# Altium schematic sheet 105358-3SC001-02_IO_BRD.SchDoc: I/O Board
size 420 x 297 mm; DrawnBy: JeSa , KaKa; Organization: Hotswap Norden AB; Address1: Knarrarnäsgatan 7; Address2: SE-164 40 Kista; Address3: Sweden; DocumentNumber: 105358-3SC001-02; SheetNumber: 5; SheetTotal: 5; PageSetup: Record=PageOptions|CenterHorizontal=True|CenterVertical=True|PrintScale=0.96|XCorrection=1.00|YCorrection=1.00|PrintKind=0|BorderSize=5000000|LeftOffset=0|BottomOffset=0|Orientation=2|PaperLength=1000|PaperWidth=1000|Scale=100|PaperSource=7|PrintQuality=-4|MediaType=1|DitherType=10|PaperKind=A3|PrintScaleMode=1
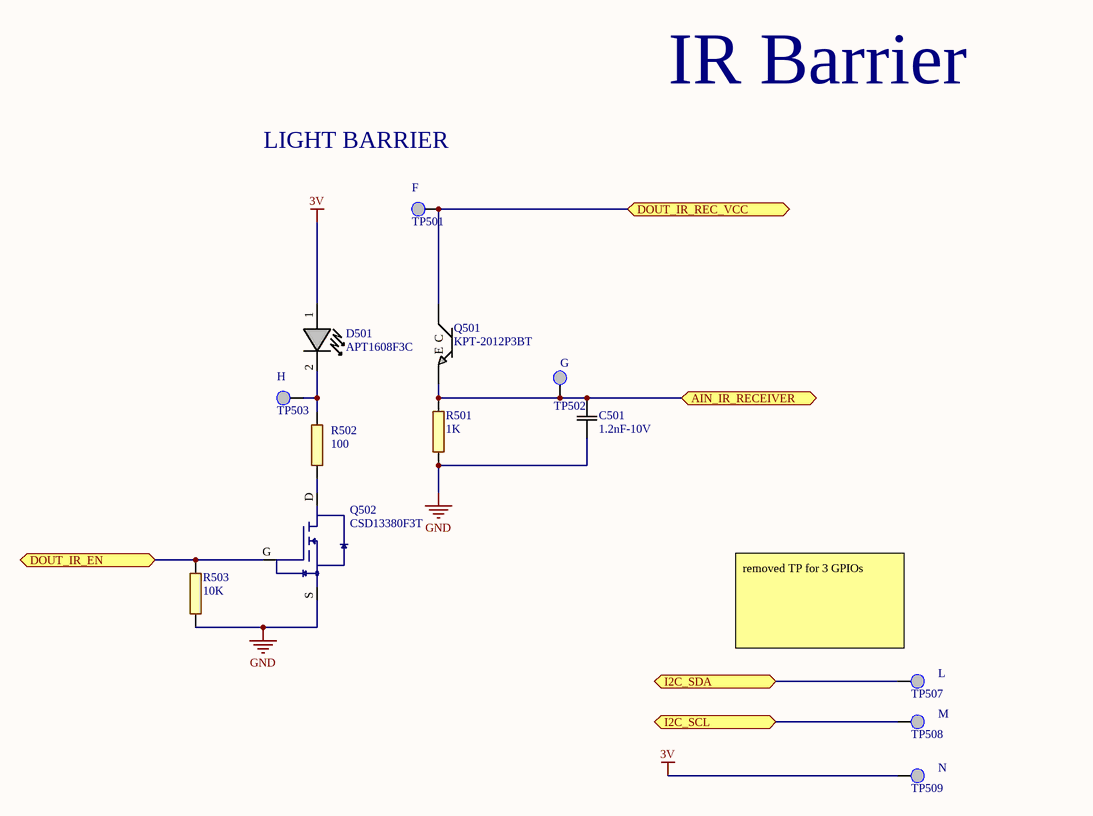
[diagram p0: 105358-3SC001-02_IO_BRD.SchDoc]

## Parts
C501  1.2nF-10V  [0402C_HIGH_DENSITY]
D501  APT1608F3C  [APT1608F3C]
Q501  KPT-2012P3BT  [APT2012P3BT]
Q502  CSD13380F3T  [CSD13380F3-DFN40P69X35-3L]
R501  1K  [0402R-GENERIC]
R502  100  [0402R-GENERIC]
R503  10K  [0402R-GENERIC]
TP501  TEST POINT  [PAD TEST POINT]  (value not drawn)  (no BOM)
TP502  TEST POINT  [PAD TEST POINT]  (value not drawn)  (no BOM)
TP503  TEST POINT  [PAD TEST POINT]  (value not drawn)  (no BOM)
TP507  TEST POINT  [PAD TEST POINT]  (value not drawn)  (no BOM)
TP508  TEST POINT  [PAD TEST POINT]  (value not drawn)  (no BOM)
TP509  TEST POINT  [PAD TEST POINT]  (value not drawn)  (no BOM)

## Ports
AIN_IR_RECEIVER, DOUT_IR_EN, DOUT_IR_REC_VCC, I2C_SCL, I2C_SDA

## Nets
3V: D501.1(A) TP509.1(Test_Point)
GND: C501.1 Q502.S R501.2 R503.2
AIN_IR_RECEIVER: C501.2 Q501.1(E) R501.1 TP502.1(Test_Point) ; port AIN_IR_RECEIVER
DOUT_IR_EN: Q502.G R503.1 ; port DOUT_IR_EN
DOUT_IR_REC_VCC: Q501.2(C) TP501.1(Test_Point) ; port DOUT_IR_REC_VCC
I2C_SCL: TP508.1(Test_Point) ; port I2C_SCL
I2C_SDA: TP507.1(Test_Point) ; port I2C_SDA
NetD501_2: D501.2(K) R502.1 TP503.1(Test_Point)
NetQ502_D: Q502.D R502.2

## Notes on the sheet
- IR Barrier
- LIGHT BARRIER
- (near TP501) F
- (near TP503) H
- (near TP502) G
- (near TP507) removed TP for 3 GPIOs
- (near TP507) L
- M
- (near TP509) N
- Title
- Customer, project
- Drawn By
- Board
- Size
- Document Number
- Sheet
- of
- Last modified
- Rev
- Build
- A3

## Library data of the parts
C501 = 0402C-1.2nF-10V: 1.2nF ±10% 10V U2J Ceramic Capacitor 0402; Manufacturer Part Number: GRM1557U1A122JA01D; Manufacturer: Murata Electronics North America; Tolerance: 5%; Capacitance: 1.2nF; Digi-Key Part Number: 490-6272-1-ND; PackageReference: 0402; Temperature Coefficient: U2J; Voltage - Rated: 10V
D501 = APT1608F3C: 0603 INFRARED DIODE; Manufacturer: Kingbright; Wavelength: 940nm; Type: Infrared (IR); Current - DC Forward (If) (Max): 50mA; Radiant Intensity (Ie) Min @ If: 1.2mW/sr @ 20mA; Voltage - Forward (Vf) (Typ): 1.2V; Viewing Angle: 120°; Supplier 1: Digi-Key; Supplier Part Number 1: 754-1433-1-ND; Manufacturer Part Number: APT1608F3C; PackageReference: 0603; Mounting Type: Surface Mount; Operating Temperature: -40°C ~ 85°C (TA); ComponentLink1Description: Datasheet; ComponentLink1URL: http://www.kingbrightusa.com/images/catalog/SPEC/APT1608F3C.pdf; Digi-Key Part Number: 754-1433-1-ND; ClassName: 3D_EXPORT
Q501 = APT2012P3BT: 0805 PHOTOTRANSISTOR; Manufacturer: Kingbright; Voltage - Collector Emitter Breakdown (Max): 30V; Current - Collector (Ic) (Max): 1mA; Current - Dark (Id) (Max): 100nA; Power - Max: 100mW; Supplier 1: Digi-Key; Supplier Part Number 1: 754-1436-1-ND; ComponentLink1Description: Datasheet; ComponentLink1URL: https://www.kingbrightusa.com/images/catalog/spec/APT2012P3BT.pdf; Manufacturer Part Number: KPT-2012P3BT; PackageReference: 0805; Digi-Key Part Number: 754-1436-1-ND; ClassName: 3D_EXPORT
Q502 = CSD13380F3T: 12V N-CHANNEL FEMTOFET MOSFET; Manufacturer: Texas Instruments; Digi-Key Part Number: CSD13380F3T; Manufacturer Part Number: CSD13380F3T; FET Type: N-Channel; Package / Case: 3-XFDFN; ComponentLink1Description: Datasheet; ComponentLink1URL: http://www.ti.com/lit/ds/symlink/csd13380f3.pdf
R501 = 0402R-1k OHM-1%-0.063W: RES SMD 1kOHM 1% 1/16W 0402; Power: 0.063W; GENERIC_OK: YES; Resistance (Ohms): 1KOhm; Tolerance: 1%; PackageReference: 0402
R502 = 0402R-100 OHM-1%-0.063W: RES SMD 100OHM 1% 1/16W 0402; Manufacturer: Yageo; Manufacturer Part Number: RC0402FR-07100RL; Power: 0.063W; GENERIC_OK: YES; Digi-Key Part Number: 311-100LRCT-ND; Resistance (Ohms): 100Ohm; Tolerance: 1%; PackageReference: 0402; Features: Moisture Resistant
R503 = 0402R-10k OHM-1%-0.063W: RES SMD 10kOHM 1% 1/16W 0402; Manufacturer: Yageo; Manufacturer Part Number: RC0402FR-0710KL; Power: 0.063W; GENERIC_OK: YES; Digi-Key Part Number: 311-10.0KLRCT-ND; Resistance (Ohms): 10KOhm; Tolerance: 1%; PackageReference: 0402; Features: Moisture Resistant
TP501-TP503 TP507-TP509 = TEST POINT: Testing Poiny; ClassName: TP